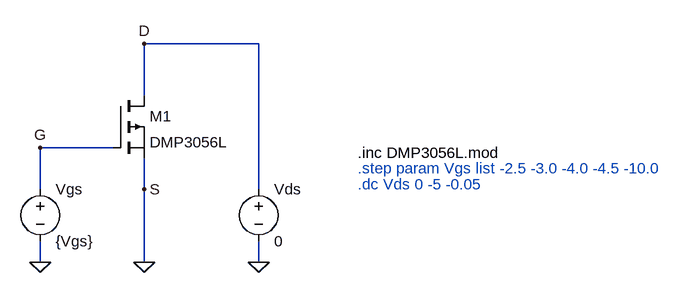
[diagram p0: schematic DMP3056L-batch.asc]
DMP3056L-batch.asc, the LTspice schematic file:
Version 4
SHEET 1 1636 680
WIRE 784 -48 608 -48
WIRE 608 32 608 -48
WIRE 560 112 448 112
WIRE 448 176 448 112
WIRE 608 176 608 128
WIRE 784 176 784 -48
WIRE 448 288 448 256
WIRE 608 288 608 176
WIRE 784 288 784 256
FLAG 608 288 0
FLAG 448 288 0
FLAG 784 288 0
FLAG 448 112 G
FLAG 608 -48 D
FLAG 608 176 S
SYMBOL pmos 560 32 R0
SYMATTR InstName M1
SYMATTR Value DMP3056L
SYMATTR Prefix X
SYMBOL voltage 784 160 R0
SYMATTR InstName Vds
SYMATTR Value 0
SYMBOL voltage 448 160 R0
WINDOW 123 0 0 Left 2
WINDOW 39 0 0 Left 2
SYMATTR InstName Vgs
SYMATTR Value {Vgs}
TEXT 936 120 Left 2 !.inc DMP3056L.mod
TEXT 936 144 Left 2 ;.step param Vgs list -2.5 -3.0 -4.0 -4.5 -10.0
TEXT 936 168 Left 2 ;.dc Vds 0 -5 -0.05

The netlist it stands for:
* DMP3056L-batch.asc
XM1 D G 0 DMP3056L  ; pins D G S
Vds D 0 0
Vgs G 0 {Vgs}
.inc DMP3056L.mod
* .step param Vgs list -2.5 -3.0 -4.0 -4.5 -10.0
* .dc Vds 0 -5 -0.05
.backanno
.end